# Altium schematic sheet BaseStation.SchDoc
size A
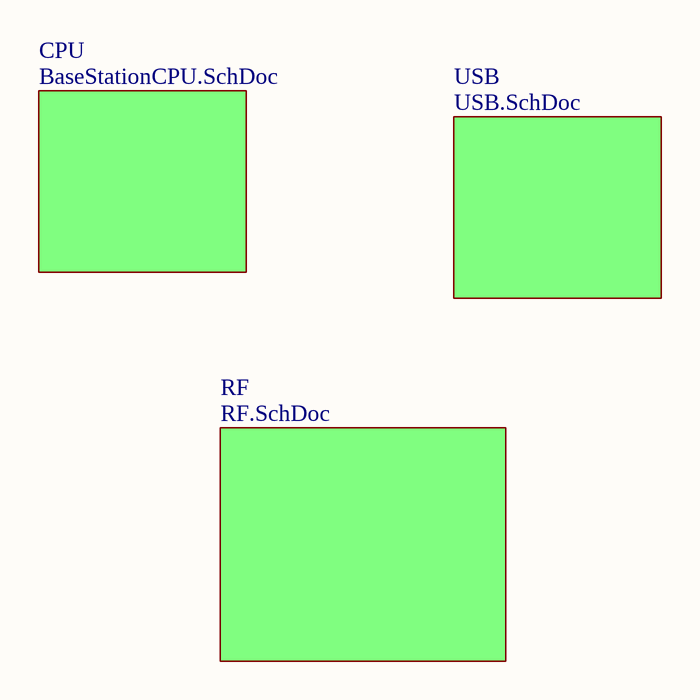
[diagram p0: BaseStation.SchDoc]

## Sub-sheets
CPU = BaseStationCPU.SchDoc: no entries
RF = RF.SchDoc: no entries
USB = USB.SchDoc: no entries